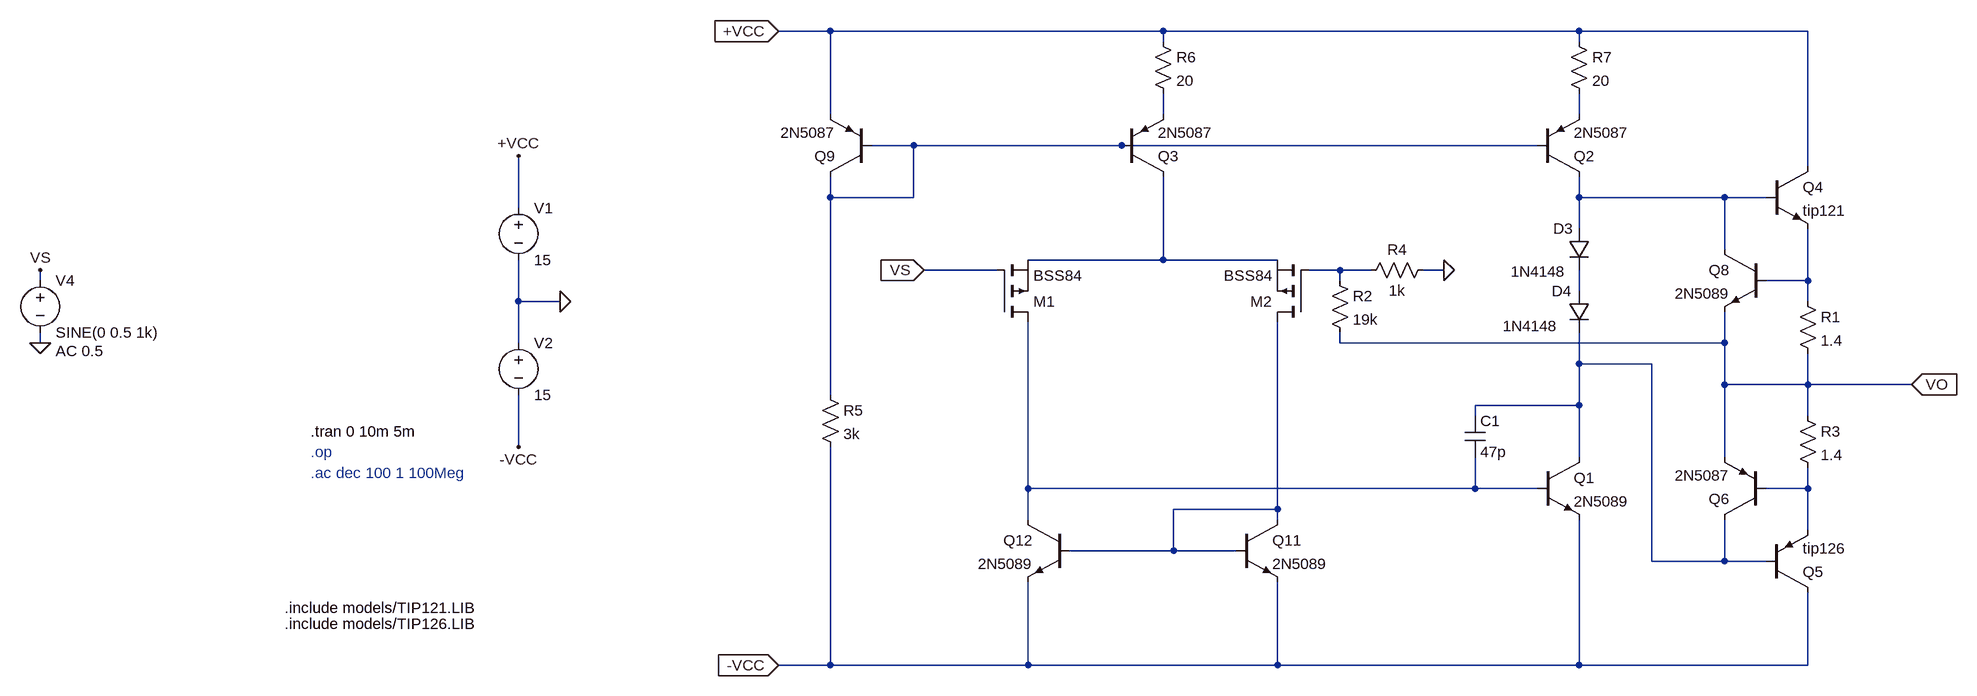
[diagram p0: schematic MalhaFechada_VFinal.asc]
MalhaFechada_VFinal.asc, the LTspice schematic file:
Version 4.1
SHEET 1 4688 1376
WIRE 512 96 432 96
WIRE 1024 96 512 96
WIRE 1664 96 1024 96
WIRE 2016 96 1664 96
WIRE 1024 112 1024 96
WIRE 1664 112 1664 96
WIRE 512 224 512 96
WIRE 1024 224 1024 192
WIRE 1664 224 1664 192
WIRE 640 272 576 272
WIRE 960 272 640 272
WIRE 1600 272 960 272
WIRE 2016 304 2016 96
WIRE 512 352 512 320
WIRE 640 352 640 272
WIRE 640 352 512 352
WIRE 1664 352 1664 320
WIRE 1888 352 1664 352
WIRE 1952 352 1888 352
WIRE 32 368 32 288
WIRE 1664 400 1664 352
WIRE 1888 432 1888 352
WIRE 1024 448 1024 320
WIRE 1024 448 816 448
WIRE 1200 448 1024 448
WIRE 768 464 656 464
WIRE 1296 464 1248 464
WIRE 1344 464 1296 464
WIRE 1456 464 1424 464
WIRE -704 480 -704 464
WIRE 1296 480 1296 464
WIRE 2016 480 2016 400
WIRE 2016 480 1952 480
WIRE 1664 496 1664 464
WIRE 32 512 32 448
WIRE 96 512 32 512
WIRE 2016 512 2016 480
WIRE -704 576 -704 560
WIRE 32 576 32 512
WIRE 1296 576 1296 560
WIRE 1888 576 1888 528
WIRE 1888 576 1296 576
WIRE 1664 608 1664 560
WIRE 1776 608 1664 608
WIRE 1888 640 1888 576
WIRE 2016 640 2016 592
WIRE 2016 640 1888 640
WIRE 2176 640 2016 640
WIRE 512 656 512 352
WIRE 1664 672 1664 608
WIRE 1664 672 1504 672
WIRE 1504 688 1504 672
WIRE 2016 688 2016 640
WIRE 32 736 32 656
WIRE 1664 752 1664 672
WIRE 1888 752 1888 640
WIRE 816 800 816 544
WIRE 1504 800 1504 752
WIRE 1504 800 816 800
WIRE 1600 800 1504 800
WIRE 2016 800 2016 768
WIRE 2016 800 1952 800
WIRE 1200 832 1200 544
WIRE 1200 832 1040 832
WIRE 816 848 816 800
WIRE 1200 848 1200 832
WIRE 2016 864 2016 800
WIRE 1040 896 1040 832
WIRE 1040 896 880 896
WIRE 1136 896 1040 896
WIRE 1776 912 1776 608
WIRE 1888 912 1888 848
WIRE 1888 912 1776 912
WIRE 1952 912 1888 912
WIRE 512 1072 512 736
WIRE 512 1072 432 1072
WIRE 816 1072 816 944
WIRE 816 1072 512 1072
WIRE 1200 1072 1200 944
WIRE 1200 1072 816 1072
WIRE 1664 1072 1664 848
WIRE 1664 1072 1200 1072
WIRE 2016 1072 2016 960
WIRE 2016 1072 1664 1072
FLAG 32 288 +VCC
FLAG 32 736 -VCC
FLAG -704 464 VS
FLAG -704 576 0
FLAG 96 512 0
FLAG 432 96 +VCC
IOPIN 432 96 In
FLAG 432 1072 -VCC
IOPIN 432 1072 In
FLAG 656 464 VS
IOPIN 656 464 In
FLAG 2176 640 VO
IOPIN 2176 640 In
FLAG 1456 464 0
SYMBOL voltage 32 352 R0
WINDOW 123 24 124 Left 2
WINDOW 39 0 0 Left 0
SYMATTR InstName V1
SYMATTR Value 15
SYMBOL voltage 32 560 R0
WINDOW 123 0 0 Left 0
WINDOW 39 0 0 Left 0
SYMATTR InstName V2
SYMATTR Value 15
SYMBOL res 496 640 R0
SYMATTR InstName R5
SYMATTR Value 3k
SYMBOL pnp 576 320 R180
SYMATTR InstName Q9
SYMATTR Value 2N5087
SYMBOL npn 1136 848 R0
SYMATTR InstName Q11
SYMATTR Value 2N5089
SYMBOL npn 880 848 M0
SYMATTR InstName Q12
SYMATTR Value 2N5089
SYMBOL npn 1600 752 R0
SYMATTR InstName Q1
SYMATTR Value 2N5089
SYMBOL pnp 1600 320 M180
SYMATTR InstName Q2
SYMATTR Value 2N5087
SYMBOL pmos 768 544 M180
SYMATTR InstName M1
SYMATTR Value BSS84
SYMBOL pmos 1248 544 R180
SYMATTR InstName M2
SYMATTR Value BSS84
SYMBOL res 2000 496 R0
SYMATTR InstName R1
SYMATTR Value 1.4
SYMBOL res 2000 672 R0
SYMATTR InstName R3
SYMATTR Value 1.4
SYMBOL npn 1952 432 M0
SYMATTR InstName Q8
SYMATTR Value 2N5089
SYMBOL voltage -704 464 R0
WINDOW 123 24 124 Left 2
WINDOW 39 0 0 Left 0
SYMATTR Value2 AC 0.5
SYMATTR InstName V4
SYMATTR Value SINE(0 0.5 1k)
SYMBOL pnp 960 320 M180
SYMATTR InstName Q3
SYMATTR Value 2N5087
SYMBOL diode 1648 400 R0
WINDOW 0 -24 0 Left 2
WINDOW 3 -89 66 Left 2
SYMATTR InstName D3
SYMATTR Value 1N4148
SYMBOL diode 1648 496 R0
WINDOW 0 -26 0 Left 2
WINDOW 3 -101 54 Left 2
SYMATTR InstName D4
SYMATTR Value 1N4148
SYMBOL res 1008 96 R0
SYMATTR InstName R6
SYMATTR Value 20
SYMBOL res 1648 96 R0
SYMATTR InstName R7
SYMATTR Value 20
SYMBOL pnp 1952 848 R180
SYMATTR InstName Q6
SYMATTR Value 2N5087
SYMBOL npn 1952 304 R0
SYMATTR InstName Q4
SYMATTR Value tip121
SYMATTR Prefix X
SYMBOL pnp 1952 960 M180
SYMATTR InstName Q5
SYMATTR Value tip126
SYMATTR Prefix X
SYMBOL cap 1488 688 R0
SYMATTR InstName C1
SYMATTR Value 47p
SYMBOL res 1280 464 R0
SYMATTR InstName R2
SYMATTR Value 19k
SYMBOL res 1440 448 R90
WINDOW 0 0 56 VBottom 2
WINDOW 3 32 56 VTop 2
SYMATTR InstName R4
SYMATTR Value 1k
TEXT -288 712 Left 2 !.tran 0 10m 5m
TEXT -288 744 Left 2 ;.op
TEXT -288 776 Left 2 ;.ac dec 100 1 100Meg
TEXT -328 984 Left 2 !.include models/TIP121.LIB
TEXT -328 1008 Left 2 !.include models/TIP126.LIB

The netlist it stands for:
* MalhaFechada_VFinal.asc
V1 +VCC 0 15
V2 0 -VCC 15
R5 N003 -VCC 3k
Q9 N003 N003 +VCC 0 2N5087
Q11 N012 N012 -VCC 0 2N5089
Q12 N010 N012 -VCC 0 2N5089
Q1 N009 N010 -VCC 0 2N5089
Q2 N004 N003 N002 0 2N5087
M1 N010 VS N005 N005 BSS84
M2 N012 N006 N005 N005 BSS84
R1 N007 VO 1.4
R3 VO N011 1.4
Q8 N004 N007 VO 0 2N5089
V4 VS 0 SINE(0 0.5 1k) AC 0.5
Q3 N005 N003 N001 0 2N5087
D3 N004 N008 1N4148
D4 N008 N009 1N4148
R6 +VCC N001 20
R7 +VCC N002 20
Q6 N009 N011 VO 0 2N5087
X§Q4 +VCC N004 N007 tip121  ; pins C B E
X§Q5 -VCC N009 N011 tip126  ; pins C B E
C1 N009 N010 47p
R2 N006 VO 19k
R4 0 N006 1k
.model D D
.lib standard.dio
.model NPN NPN
.model PNP PNP
.lib standard.bjt
.model NMOS NMOS
.model PMOS PMOS
.lib standard.mos
.tran 0 10m 5m
* .op
* .ac dec 100 1 100Meg
.include models/TIP121.LIB
.include models/TIP126.LIB
.backanno
.end